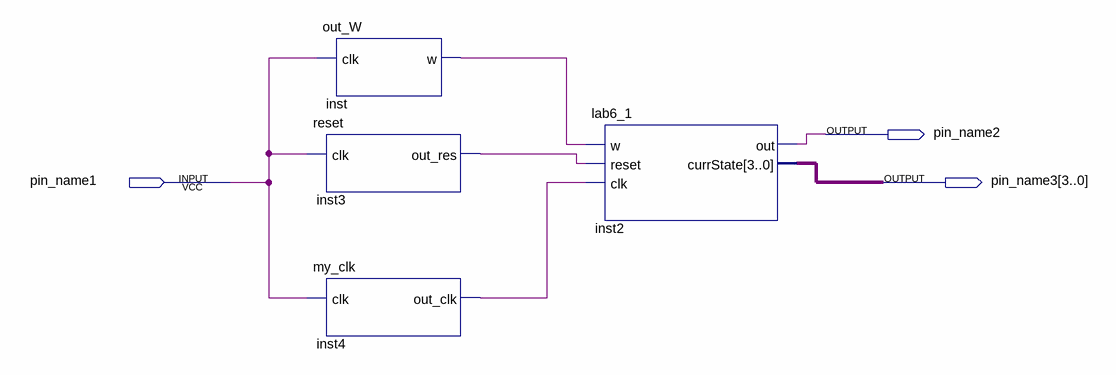
[diagram p0: schematic sheet]
// Quartus schematic lab6_new.bdf as structural Verilog: 4 symbols, 3 pins
module lab6_new (
  input  pin_name1,
  output pin_name2,
  output [3:0] pin_name3
);

  wire inst3_out_res, inst4_out_clk, inst_w;

  reset inst3 (.clk(pin_name1), .out_res(inst3_out_res));
  my_clk inst4 (.clk(pin_name1), .out_clk(inst4_out_clk));
  out_W inst (.clk(pin_name1), .w(inst_w));
  lab6_1 inst2 (.w(inst_w), .reset(inst3_out_res), .clk(inst4_out_clk), .out(pin_name2), .currState(pin_name3));
endmodule
